# EAGLE design Controller (EAGLE 7.7.0)
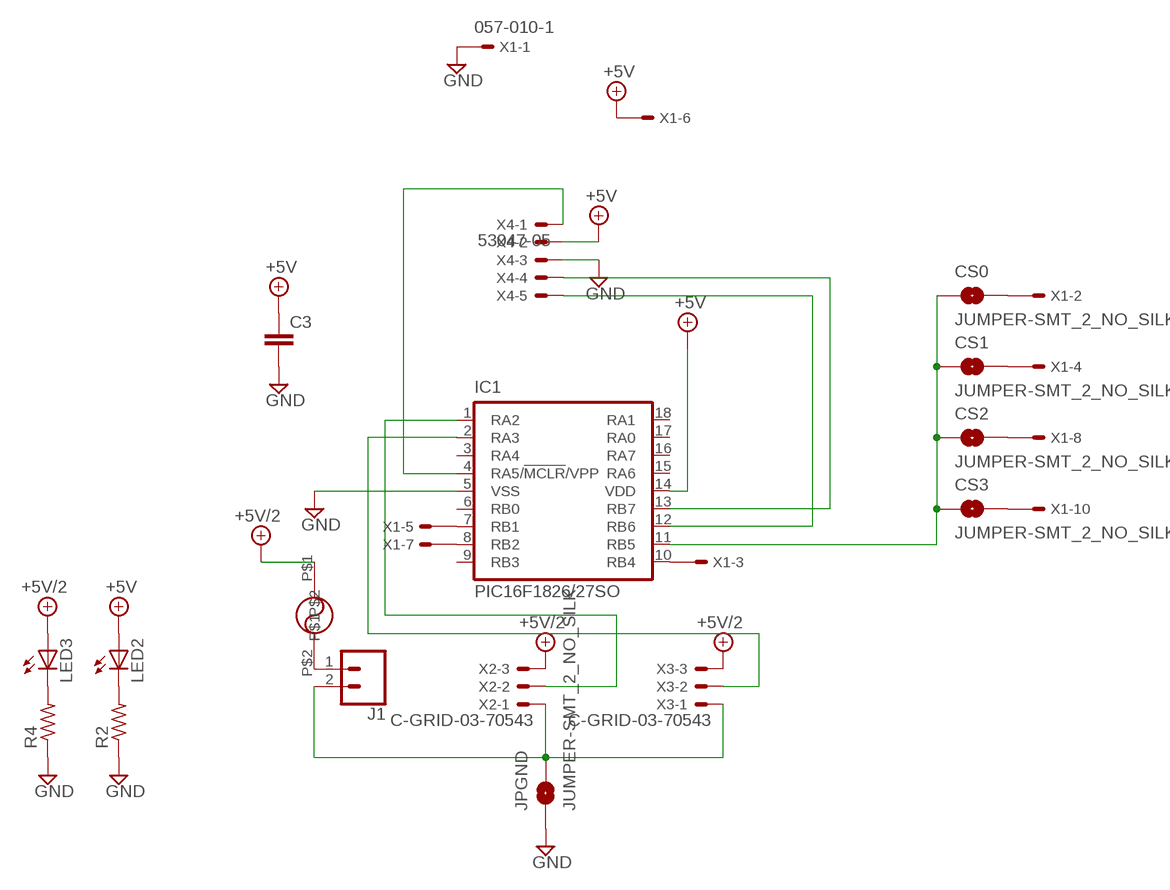
[diagram p0: schematic, sheet 1]

## Parts
C3  C-EUC1206  [C1206]
CS0  JUMPER-SMT_2_NO_SILK  [SMT-JUMPER_2_NO_SILK]
CS1  JUMPER-SMT_2_NO_SILK  [SMT-JUMPER_2_NO_SILK]
CS2  JUMPER-SMT_2_NO_SILK  [SMT-JUMPER_2_NO_SILK]
CS3  JUMPER-SMT_2_NO_SILK  [SMT-JUMPER_2_NO_SILK]
IC1  PIC16F1826/27SO  [SO-18W]
J1  CONN_023.5MM  [SCREWTERMINAL-3.5MM-2]
JPGND  JUMPER-SMT_2_NO_SILK  [SMT-JUMPER_2_NO_SILK]
LED2  LEDCHIPLED_1206  [CHIPLED_1206]
LED3  LEDCHIPLED_1206  [CHIPLED_1206]
R2  R-US_R1206  [R1206]
R4  R-US_R1206  [R1206]
U$3  0034.6081  [MSF250]
X1  057-010-1  [057-010-1]
X2  C-GRID-03-70543  [70543-03]
X3  C-GRID-03-70543  [70543-03]
X4  53047-05  [53047-05]

## Nets
+5V: C3.1 IC1.14(VDD) LED2.A X1.6 X4.2
+5V/2: LED3.A U$3.P$1 X2.3 X3.3
GND: C3.2 IC1.5(VSS) JPGND.1 R2.1 R4.1 X1.1 X4.3
N$1: IC1.10(RB4) X1.3
N$2: IC1.7(RB1) X1.5
N$3: IC1.8(RB2) X1.7
N$4: CS0.1 CS1.1 CS2.1 CS3.1 IC1.11(RB5)
N$5: CS0.2 X1.2
N$6: CS1.2 X1.4
N$7: CS2.2 X1.8
N$8: CS3.2 X1.10
N$9: J1.1 U$3.P$2
N$10: LED3.C R4.2
N$11: J1.2 JPGND.2 X2.1 X3.1
N$12: IC1.1(RA2) X2.2
N$13: IC1.2(RA3) X3.2
N$14: IC1.4(RA5/!MCLR!/VPP) X4.1
N$15: IC1.13(RB7) X4.4
N$16: IC1.12(RB6) X4.5
N$18: LED2.C R2.2
Unconnected: IC1.3(RA4) IC1.6(RB0) IC1.9(RB3) IC1.15(RA6) IC1.16(RA7) IC1.17(RA0) IC1.18(RA1) X1.9

## Library data of the parts
C3 = resistor:C-EU: CAPACITOR, European symbol
CS0 CS1-CS3 JPGND = SparkFun-Jumpers:JUMPER-SMT_2_NO: Normally open jumper This jumper has two pads in close proximity to each other. Apply solder to close the connection. Round pads are easier to solder for beginners, but are a lot larger. SparkFun Product that uses the round pads: SparkFun EL Sequencer <https://www.sparkfun.com/products/12781>
IC1 = microchip:PIC16*F1826/27: 18/20/28-Pin Flash Microcontrollers with nanoWatt XLP Technology Source: www.microchip.com PIC16F1827.pdf
J1 = SparkFun-Connectors:CONN_02: Multi connection point. Often used as Generic Header-pin footprint for 0.1 inch spaced/style header connections On any of the 0.1 inch spaced packages, you can populate with these: Break Away Headers - Straight <https://www.sparkfun.com/products/116> (PRT-00116) Break Away Male Headers - Right Angle <https://www.sparkfun.com/products/553> (PRT-00553) Female Headers <https://www.sparkfun.com/products/115> (PRT-00115) Break Away Headers - Machine Pin <https://www.sparkfun.com/products/117> (PRT-00117) Break Away Female Headers - Swiss Machine Pin <https://www.sparkfun.com/products/743> (PRT-00743) For SCREWTERMINALS and SPRING TERMINALS visit here: Screw Terimnals on SparkFun.com <https://www.sparkfun.com/search/results?term=Screw+Terminals> (5mm/3.5mm/2.54mm spacing) This device is also useful as a general connection point to wire up your design to another part of your project. Our various solder wires solder well into these plated through hole pads. Hook-Up Wire - Assortment (Stranded, 22 AWG) <https://www.sparkfun.com/products/11375> (PRT-11375) Hook-Up Wire - Assortment (Solid Core, 22 AWG) <https://www.sparkfun.com/products/11367> (PRT-11367) View the entire wire category on our website here <https://www.sparkfun.com/categories/141> Special notes: Molex polarized connector foot print use with: PRT-08233 with associated crimp pins and housings. 2.54_SCREWTERM for use with PRT-10571. 3.5mm Screw Terminal footprints for PRT-08084 5mm Screw Terminal footprints for use with PRT-08432; PROD_ID: CONN-08399
LED2 LED3 = led:LED: LED OSRAM: - CHIPLED LG R971, LG N971, LY N971, LG Q971, LY Q971, LO R971, LY R971 LH N974, LH R974 LS Q976, LO Q976, LY Q976 LO Q996 - Hyper CHIPLED LW Q18S LB Q993, LB Q99A, LB R99A - SideLED LS A670, LO A670, LY A670, LG A670, LP A670 LB A673, LV A673, LT A673, LW A673 LH A674 LY A675 LS A676, LA A676, LO A676, LY A676, LW A676 LS A679, LY A679, LG A679 - Hyper Micro SIDELED® LS Y876, LA Y876, LO Y876, LY Y876 LT Y87S - SmartLED LW L88C, LW L88S LB L89C, LB L89S, LG L890 LS L89K, LO L89K, LY L89K LS L896, LA L896, LO L896, LY L896 - TOPLED LS T670, LO T670, LY T670, LG T670, LP T670 LSG T670, LSP T670, LSY T670, LOP T670, LYG T670 LG T671, LOG T671, LSG T671 LB T673, LV T673, LT T673, LW T673 LH T674 LS T676, LA T676, LO T676, LY T676, LB T676, LH T676, LSB T676, LW T676 LB T67C, LV T67C, LT T67C, LS T67K, LO T67K, LY T67K, LW E67C LS E67B, LA E67B, LO E67B, LY E67B, LB E67C, LV E67C, LT E67C LW T67C LS T679, LY T679, LG T679 LS T770, LO T770, LY T770, LG T770, LP T770 LB T773, LV T773, LT T773, LW T773 LH T774 LS E675, LA E675, LY E675, LS T675 LS T776, LA T776, LO T776, LY T776, LB T776 LHGB T686 LT T68C, LB T68C - Hyper Mini TOPLED® LB M676 - Mini TOPLED Santana® LG M470 LS M47K, LO M47K, LY M47K Source: http://www.osram.convergy.de LUXEON: - LUMILED® LXK2-PW12-R00, LXK2-PW12-S00, LXK2-PW14-U00, LXK2-PW14-V00 LXK2-PM12-R00, LXK2-PM12-S00, LXK2-PM14-U00 LXK2-PE12-Q00, LXK2-PE12-R00, LXK2-PE12-S00, LXK2-PE14-T00, LXK2-PE14-U00 LXK2-PB12-K00, LXK2-PB12-L00, LXK2-PB12-M00, LXK2-PB14-N00, LXK2-PB14-P00, LXK2-PB14-Q00 LXK2-PR12-L00, LXK2-PR12-M00, LXK2-PR14-Q00, LXK2-PR14-R00 LXK2-PD12-Q00, LXK2-PD12-R00, LXK2-PD12-S00 LXK2-PH12-R00, LXK2-PH12-S00 LXK2-PL12-P00, LXK2-PL12-Q00, LXK2-PL12-R00 Source: www.luxeon.com KINGBRIGHT: KA-3528ASYC Source: www.kingbright.com
R2 R4 = resistor:R-US_: RESISTOR, American symbol
U$3 = JSB2:0034.6081
X1 = con-panduit:057-010-: CONNECTOR 10-pin series 057 contact pc board low profile headers; OC_FARNELL: unknown; OC_NEWARK: unknown
X2 X3 = con-molex:C-GRID-03: CONNECTOR wire to board 2.54 mm (0.100") pitch header; OC_FARNELL: unknown; OC_NEWARK: unknown
X4 = con-molex:53?-05: CONNECTOR wire to board 1.25 mm (.049 inch) pitch header; MF: MOLEX; MPN: 53047-0510; OC_FARNELL: 9732861; OC_NEWARK: 38C9901

## Board
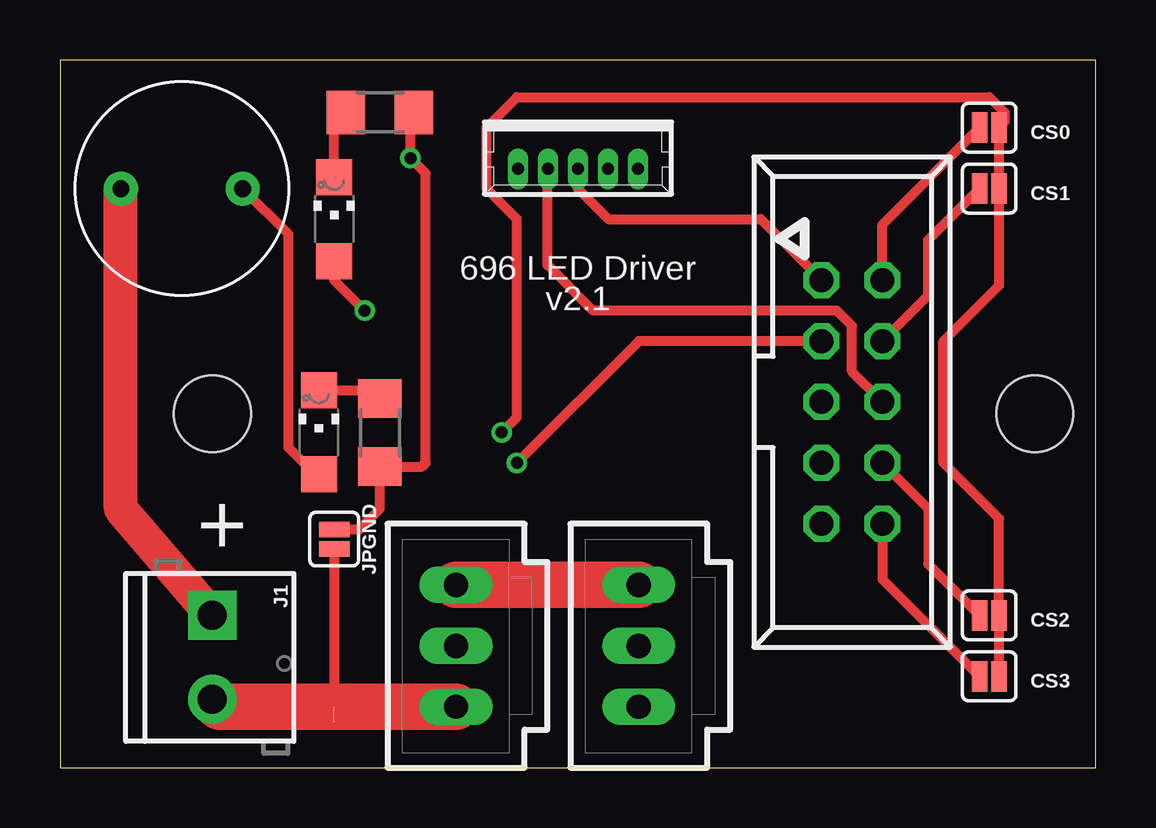
[diagram p1: board, top side]
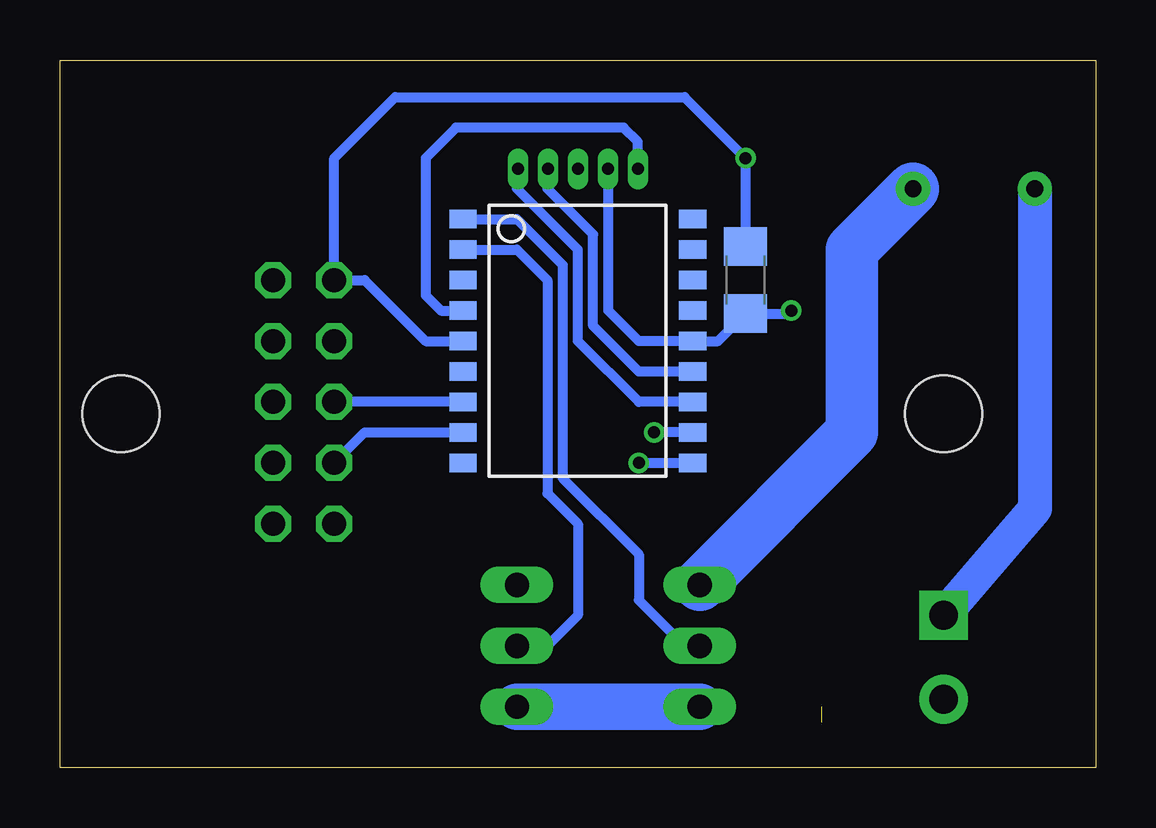
[diagram p2: board, bottom side, seen from below]

Size 43.18 x 29.49 mm. Coordinates in mm from the lower left corner, seen from the top.
Outline: 0,0 43.18,0 43.18,29.49 0,29.49 0,0
Copper layers (1*16): Top 0.0356mm / dielectric 1.5011mm / Bottom 0.0356mm
Design rules "Oshpark": minimum track width 6mil, minimum drill 13mil, track to track 6mil, track to pad 6mil, pad to pad 6mil, via to via 6mil, smd to smd 6mil, copper to edge 15mil, drill to drill 6mil, minimum pad ring 7mil, minimum via ring 7mil, stop-mask expansion 3mil, vias tented up to drill 0mil, thermal gap 10mil
Holes 3.2 mm at 6.35,14.74 40.64,14.74

### Footprints (pad centres in the part's own frame; a part is rotated, then mirrored left to right if it is on the bottom)
C1206 = smd 1.6 x 1.8: 1 -1.4,0; 2 1.4,0
SMT-JUMPER_2_NO_SILK = smd 0.635 x 1.27: 1 -0.406,0; 2 0.406,0
SO-18W = smd 0.762 x 1.143: 1 -5.08,-4.788; 2 -3.81,-4.788; 3 -2.54,-4.788; 4 -1.27,-4.788; 5 0,-4.788; 6 1.27,-4.788; 7 2.54,-4.788; 8 3.81,-4.788; 9 5.08,-4.788; 10 5.08,4.788; 11 3.81,4.788; 12 2.54,4.788; 13 1.27,4.788; 14 0,4.788; 15 -1.27,4.788; 16 -2.54,4.788; 17 -3.81,4.788; 18 -5.08,4.788
SCREWTERMINAL-3.5MM-2 = drill 1.2 pad 2.032 square: 1 0,0 | drill 1.2 pad 2.032: 2 3.5,0
CHIPLED_1206 = smd 1.5 x 1.5: A 0,-1.75; C 0,1.75
R1206 = smd 1.6 x 1.803: 1 -1.422,0; 2 1.422,0
MSF250 = drill 0.7 pad 1.422: P$1 -2.54,0; P$2 2.54,0
057-010-1 = drill 1 octagon: 1 -5.08,-1.27; 2 -5.08,1.27; 3 -2.54,-1.27; 4 -2.54,1.27; 5 0,-1.27; 6 0,1.27; 7 2.54,-1.27; 8 2.54,1.27; 9 5.08,-1.27; 10 5.08,1.27
70543-03 = drill 1.016 long: 1 -2.54,0; 2 0,0; 3 2.54,0
53047-05 = drill 0.5 pad 0.698 long: 1 2.5,0.45; 2 1.25,0.45; 3 0,0.45; 4 -1.25,0.45; 5 -2.5,0.45

### Placement (x,y rotation side)
C3  14.6,20.32 90 bottom
CS0  38.73,26.67 180 top
CS1  38.73,24.13 180 top
CS2  38.73,6.35 180 top
CS3  38.73,3.81 180 top
IC1  21.59,17.78 270 bottom
J1  6.35,6.35 270 top
JPGND  11.43,9.53 270 top
LED2  11.43,22.86 0 top
LED3  10.79,13.97 0 top
R2  13.33,27.3 180 top
R4  13.33,13.97 90 top
U$3  5.08,24.13 180 top
X1  33.02,15.24 270 top
X2  16.51,5.08 90 top
X3  24.13,5.08 90 top
X4  21.59,25.4 180 top

### Tracks (layer width: path | path; a pad name or v marks a point on that pad's centre or on a via)
+5V  (via drill 0.5)
  Top 0.406: X1.6 33.02,16.51 33.02,18.41 32.38,19.05 22.23,19.05 20.32,20.95 20.32,24.93 X4.2 | v12.7,19.05 11.43,20.32 LED2.A
  Bottom 0.406: X4.2 20.32,24.93 20.32,19.05 19.05,17.78 IC1.14 15.74,17.78 C3.1 12.83,18.92 v12.7,19.05
+5V/2
  Top 0.406: LED3.A 10.64,12.22 9.53,13.34 9.53,22.23 U$3.P$1
  Top 1.93: X3.3 X2.3
  Bottom 2.184: U$3.P$1 10.16,21.59 10.16,13.97 X2.3
GND  (via drill 0.5)
  Top 0.406: X4.3 21.59,24.13 22.86,22.86 29.21,22.86 X1.1 | R2.1 14.6,27.15 v14.6,25.4 15.24,24.77 15.24,12.7 15.09,12.55 R4.1 13.33,10.79 12.47,9.93 JPGND.1
  Bottom 0.406: IC1.5 27.94,17.78 30.48,20.32 X1.1 31.75,25.4 29.21,27.94 17.14,27.94 v14.6,25.4 C3.2
N$1  (via drill 0.5)
  Top 0.406: X1.3 24.13,17.78 v19.05,12.7
  Bottom 0.406: v19.05,12.7 IC1.10
N$2
  Bottom 0.406: IC1.7 X1.5
N$3
  Bottom 0.406: X1.7 30.48,13.97 IC1.8
N$4  (via drill 0.5)
  Top 0.406: CS3.1 CS2.1 39.14,10.39 36.83,12.7 36.83,17.78 39.14,20.09 CS1.1 CS0.1 39.37,26.9 39.37,27.3 38.73,27.94 19.05,27.94 17.78,26.67 17.78,24.13 19.05,22.86 19.05,14.61 v18.41,13.97
  Bottom 0.406: IC1.11 v18.41,13.97
N$5
  Top 0.406: X1.2 34.29,22.63 CS0.2
N$6
  Top 0.406: X1.4 36.2,19.68 36.2,22 CS1.2
N$7
  Top 0.406: X1.8 36.2,10.79 36.2,8.48 CS2.2
N$8
  Top 0.406: X1.10 34.29,7.85 CS3.2
N$9
  Top 1.422: J1.1 2.54,10.79 U$3.P$2
  Bottom 1.422: U$3.P$2 2.54,10.79 J1.1
N$10
  Top 0.406: LED3.C 13.01,15.72 R4.2
N$11  (1 unrouted)
  Top 0.406: JPGND.2 11.43,1.91
  Top 1.93: J1.2 6.66,2.54 X2.1
  Bottom 1.93: X3.1 X2.1
N$12
  Bottom 0.406: IC1.1 24.13,22.86 22.23,20.95 22.23,12.06 19.05,8.89 19.05,6.99 17.14,5.08 X2.2
N$13
  Bottom 0.406: IC1.2 24.13,21.59 22.86,20.32 22.86,11.43 21.59,10.16 21.59,6.35 22.86,5.08 X3.2
N$14
  Bottom 0.406: X4.1 19.09,26.07 19.68,26.67 26.67,26.67 27.94,25.4 27.94,19.68 27.3,19.05 IC1.4
N$15
  Bottom 0.406: IC1.13 19.05,16.51 20.95,18.41 20.95,22.23 22.86,24.13 22.86,24.93 X4.4
N$16
  Bottom 0.406: IC1.12 19.05,15.24 21.59,17.78 21.59,21.59 24.13,24.13 24.13,24.91 X4.5
N$18
  Top 0.406: LED2.C 11.43,26.82 R2.2

### Text on the board
tPlace: 696 LED Driver | v2.1 | +